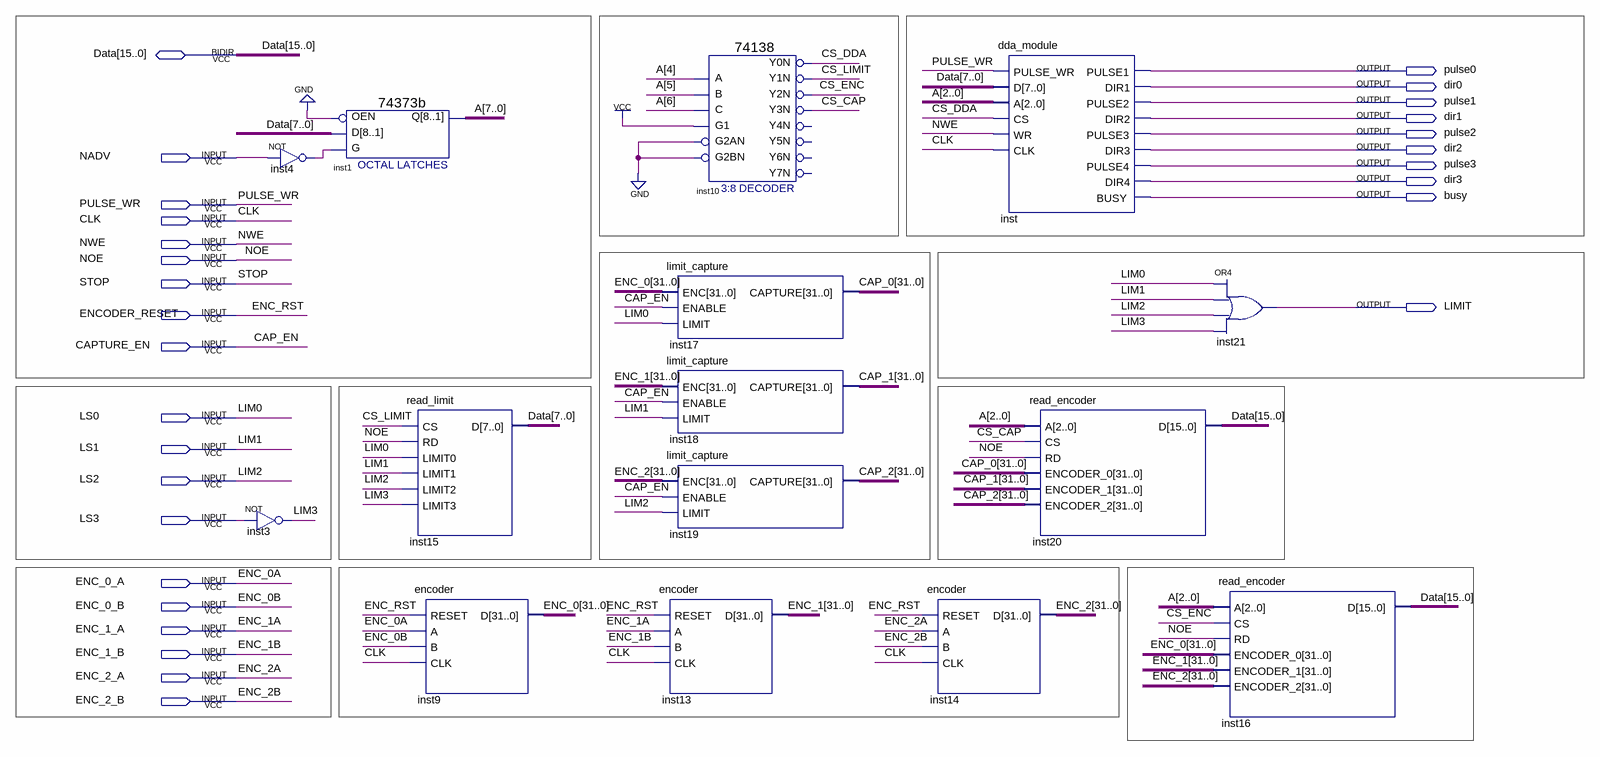
[diagram p0: schematic sheet]
// Quartus schematic xuat_xung.bdf as structural Verilog: 15 symbols, 29 pins
module xuat_xung (
  input  NADV,
  input  PULSE_WR,
  input  CLK,
  input  NWE,
  input  NOE,
  input  STOP,
  input  ENCODER_RESET,
  input  CAPTURE_EN,
  input  LS0,
  input  LS1,
  input  LS2,
  input  LS3,
  input  ENC_0_A,
  input  ENC_0_B,
  input  ENC_1_A,
  input  ENC_1_B,
  input  ENC_2_A,
  input  ENC_2_B,
  inout  [15:0] Data,
  output pulse0,
  output dir0,
  output pulse1,
  output dir1,
  output pulse2,
  output dir2,
  output pulse3,
  output dir3,
  output busy,
  output LIMIT
);

  wire CS_CAP, CS_DDA, CS_ENC, CS_LIMIT, inst4_out, LIM3;
  wire [7:0] A;
  wire [31:0] CAP_0, CAP_1, CAP_2, ENC_0, ENC_1, ENC_2;

  not inst4 (inst4_out, NADV);
  not inst3 (LIM3, LS3);
  \74373b  inst1 (.D(Data[7:0]), .G(inst4_out), .OEN(1'b0), .Q(A));
  read_limit inst15 (.CS(CS_LIMIT), .RD(NOE), .LIMIT0(LS0), .LIMIT1(LS1), .LIMIT2(LS2), .LIMIT3(LIM3), .D(Data[7:0]));
  encoder inst9 (.RESET(ENCODER_RESET), .A(ENC_0_A), .B(ENC_0_B), .CLK(CLK), .D(ENC_0));
  limit_capture inst17 (.ENC(ENC_0), .ENABLE(CAPTURE_EN), .LIMIT(LS0), .CAPTURE(CAP_0));
  limit_capture inst18 (.ENC(ENC_1), .ENABLE(CAPTURE_EN), .LIMIT(LS1), .CAPTURE(CAP_1));
  limit_capture inst19 (.ENC(ENC_2), .ENABLE(CAPTURE_EN), .LIMIT(LS2), .CAPTURE(CAP_2));
  encoder inst13 (.RESET(ENCODER_RESET), .A(ENC_1_A), .B(ENC_1_B), .CLK(CLK), .D(ENC_1));
  \74138  inst10 (
    .A(A[4]), .B(A[5]), .G1(1'b1), .C(A[6]), .G2AN(1'b0), .G2BN(1'b0), .Y0N(CS_DDA), .Y1N(CS_LIMIT),
    .Y2N(CS_ENC), .Y3N(CS_CAP));  // open: Y4N, Y5N, Y6N, Y7N
  encoder inst14 (.RESET(ENCODER_RESET), .A(ENC_2_A), .B(ENC_2_B), .CLK(CLK), .D(ENC_2));
  dda_module inst (
    .PULSE_WR(PULSE_WR), .D(Data[7:0]), .A(A[2:0]), .CS(CS_DDA), .WR(NWE), .CLK(CLK), .PULSE1(pulse0),
    .DIR1(dir0), .PULSE2(pulse1), .DIR2(dir1), .PULSE3(pulse2), .DIR3(dir2), .PULSE4(pulse3), .DIR4(dir3),
    .BUSY(busy));
  read_encoder inst20 (
    .A(A[2:0]), .CS(CS_CAP), .RD(NOE), .ENCODER_0(CAP_0), .ENCODER_1(CAP_1), .ENCODER_2(CAP_2), .D(Data));
  or inst21 (LIMIT, LS0, LS1, LS2, LIM3);
  read_encoder inst16 (
    .A(A[2:0]), .CS(CS_ENC), .RD(NOE), .ENCODER_0(ENC_0), .ENCODER_1(ENC_1), .ENCODER_2(ENC_2), .D(Data));

  // Other names for the same wires on the sheet: CAP_EN = CAPTURE_EN; ENC_0A = ENC_0_A; ENC_0B = ENC_0_B;
  //   ENC_1A = ENC_1_A; ENC_1B = ENC_1_B; ENC_2A = ENC_2_A; ENC_2B = ENC_2_B; ENC_RST = ENCODER_RESET; LIM0 = LS0;
  //   LIM1 = LS1; LIM2 = LS2
endmodule
